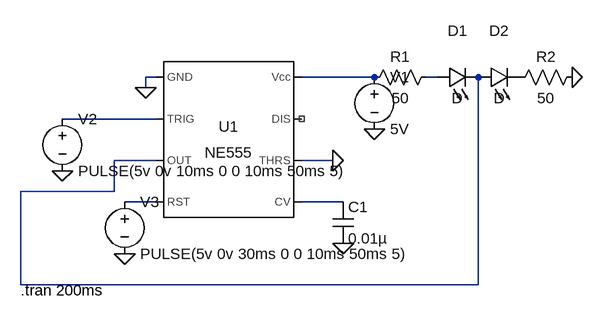
[diagram p0: schematic SourceSink.asc]
SourceSink.asc, the LTspice schematic file:
Version 4
SHEET 1 880 680
WIRE 80 80 64 80
WIRE 416 80 304 80
WIRE 512 80 496 80
WIRE 64 96 64 80
WIRE 80 144 -64 144
WIRE 80 208 16 208
WIRE 352 208 304 208
WIRE 16 256 16 208
WIRE 16 256 -128 256
WIRE 80 272 32 272
WIRE 368 272 304 272
WIRE -128 400 -128 256
WIRE 576 400 576 80
WIRE 576 400 -128 400
FLAG 64 96 0
FLAG -64 224 0
FLAG 32 352 0
FLAG 416 160 0
FLAG 368 336 0
FLAG 352 208 0
FLAG 720 80 0
SYMBOL Misc\\NE555 192 176 R0
SYMATTR InstName U1
SYMBOL voltage 416 64 R0
SYMATTR InstName V1
SYMATTR Value 5V
SYMBOL voltage -64 128 R0
WINDOW 123 0 0 Left 0
WINDOW 39 0 0 Left 0
SYMATTR InstName V2
SYMATTR Value PULSE(5v 0v 10ms 0 0 10ms 50ms 5)
SYMBOL voltage 32 256 R0
WINDOW 123 0 0 Left 0
WINDOW 39 0 0 Left 0
SYMATTR InstName V3
SYMATTR Value PULSE(5v 0v 30ms 0 0 10ms 50ms 5)
SYMBOL cap 352 272 R0
SYMATTR InstName C1
SYMATTR Value 0.01µ
SYMBOL LED 512 96 R270
WINDOW 0 72 32 VTop 2
WINDOW 3 0 32 VBottom 2
SYMATTR InstName D1
SYMBOL LED 576 96 R270
WINDOW 0 72 32 VTop 2
WINDOW 3 0 32 VBottom 2
SYMATTR InstName D2
SYMBOL res 512 64 R90
WINDOW 0 0 56 VBottom 2
WINDOW 3 32 56 VTop 2
SYMATTR InstName R1
SYMATTR Value 50
SYMBOL res 736 64 R90
WINDOW 0 0 56 VBottom 2
WINDOW 3 32 56 VTop 2
SYMATTR InstName R2
SYMATTR Value 50
TEXT -128 408 Left 2 !.tran 200ms

The netlist it stands for:
* SourceSink.asc
XU1 0 N003 N004 N005 N006 0 NC_01 N001 NE555  ; pins GND TRIG OUT RST CV THRS DIS Vcc
V1 N001 0 5V
V2 N003 0 PULSE(5v 0v 10ms 0 0 10ms 50ms 5)
V3 N005 0 PULSE(5v 0v 30ms 0 0 10ms 50ms 5)
C1 N006 0 0.01µ
D1 N002 N004 D
D2 N004 P001 D
R1 N002 N001 50
R2 0 P001 50
.model D D
.lib standard.dio
.tran 200ms
.lib NE555.sub
.backanno
.end